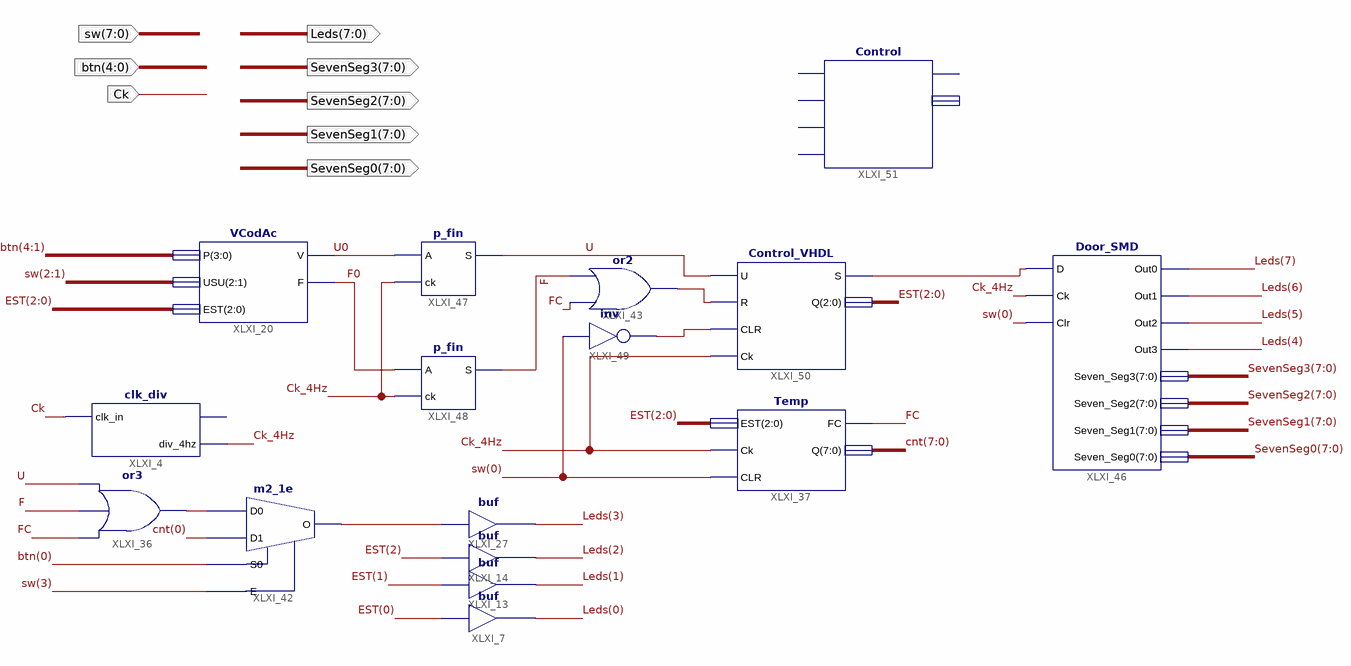
[diagram p0: schematic sheet 1]
// Xilinx ISE schematic MyDesign.sch (spartan6) as structural Verilog: 16 symbols, 8 ports
module MyDesign (
  input  Ck,
  input  [7:0] sw,
  input  [4:0] btn,
  output [7:0] SevenSeg3,
  output [7:0] SevenSeg2,
  output [7:0] SevenSeg1,
  output [7:0] SevenSeg0,
  output [7:0] Leds
);

  wire Ck_4Hz, F, F0, FC, U, U0, XLXN_65, XLXN_93, XLXN_94, XLXN_99, XLXN_107;
  wire [2:0] EST;
  wire [7:0] cnt;

  VCodAc XLXI_20 (.EST(EST), .F(F0), .P(btn[4:1]), .USU(sw[2:1]), .V(U0));
  clk_div XLXI_4 (.clk_in(Ck), .div_4hz(Ck_4Hz));  // open: div_1hz
  or XLXI_43 (XLXN_99, FC, F);
  Temp XLXI_37 (.Ck(Ck_4Hz), .CLR(sw[0]), .EST(EST), .FC(FC), .Q(cnt));
  buf XLXI_27 (Leds[3], XLXN_94);
  or XLXI_36 (XLXN_93, FC, F, U);
  m2_1e XLXI_42 (.D0(XLXN_93), .D1(cnt[0]), .E(sw[3]), .S0(btn[0]), .O(XLXN_94));
  buf XLXI_13 (Leds[1], EST[1]);
  buf XLXI_7 (Leds[0], EST[0]);
  buf XLXI_14 (Leds[2], EST[2]);
  Door_SMD XLXI_46 (
    .Ck(Ck_4Hz), .Clr(sw[0]), .D(XLXN_65), .Out0(Leds[7]), .Out1(Leds[6]), .Out2(Leds[5]), .Out3(Leds[4]),
    .Seven_Seg0(SevenSeg0), .Seven_Seg1(SevenSeg1), .Seven_Seg2(SevenSeg2), .Seven_Seg3(SevenSeg3));
  p_fin XLXI_47 (.A(U0), .ck(Ck_4Hz), .S(U));
  p_fin XLXI_48 (.A(F0), .ck(Ck_4Hz), .S(F));
  not XLXI_49 (XLXN_107, sw[0]);
  Control_VHDL XLXI_50 (.U(U), .R(XLXN_99), .CLR(XLXN_107), .Ck(Ck_4Hz), .S(XLXN_65), .Q(EST));
  Control XLXI_51 ();  // open: Ck, CLR, EST, R, S, U
endmodule
